# Altium schematic sheet arm_sheet.SchDoc
size A4
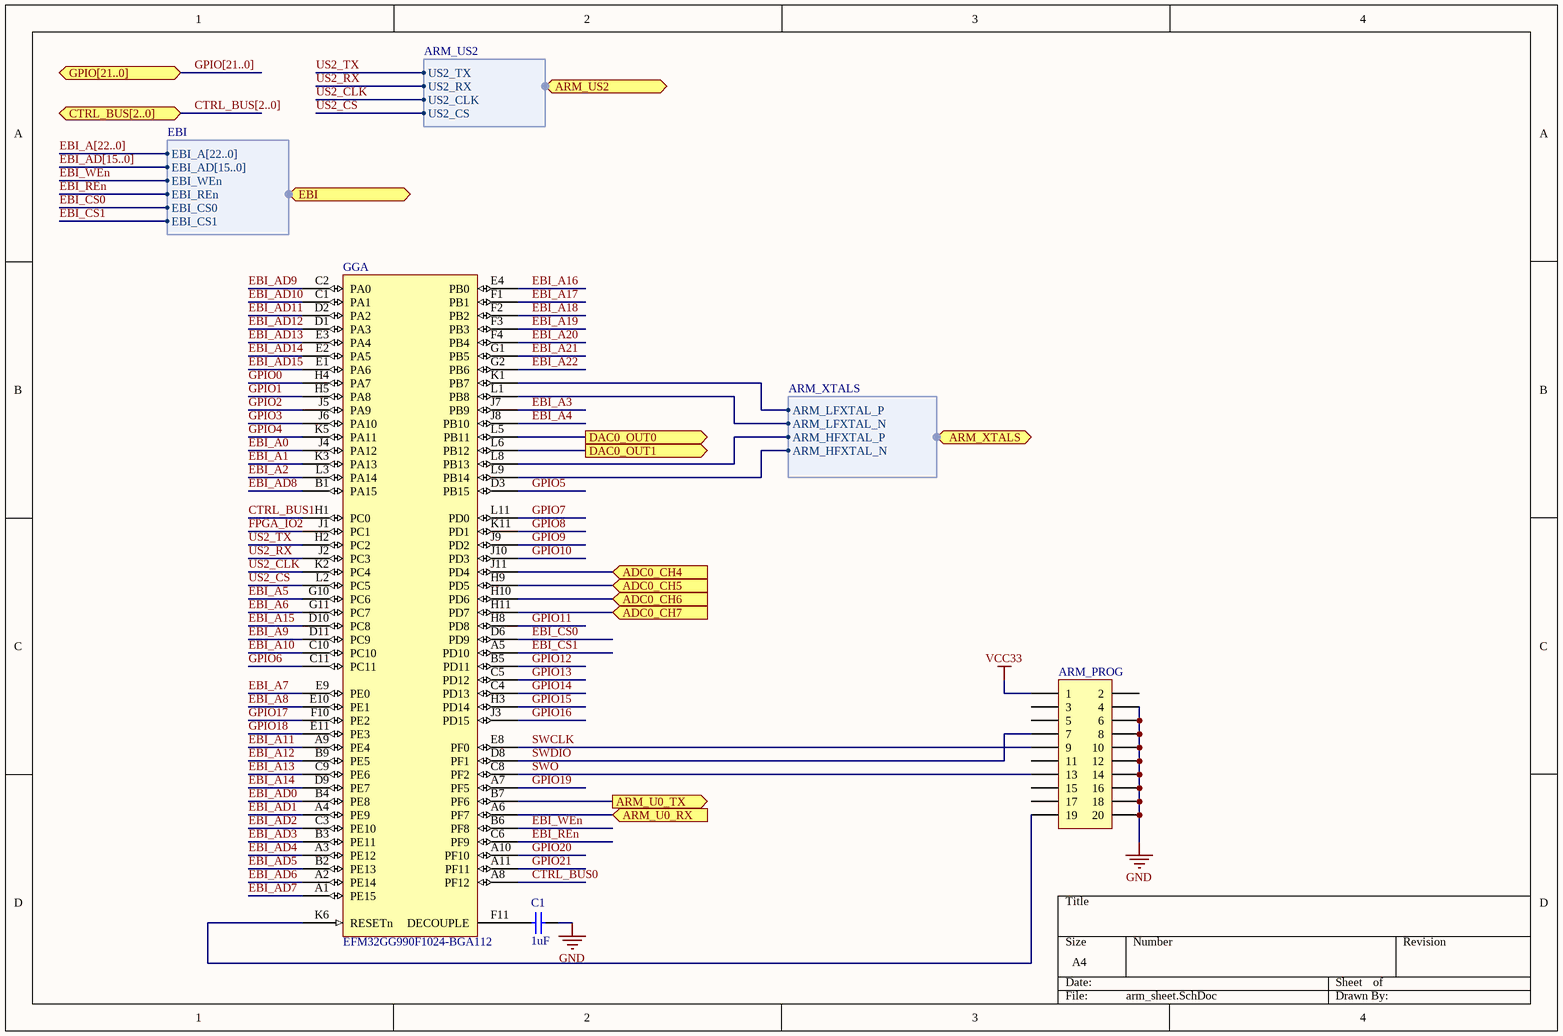
[diagram p0: arm_sheet.SchDoc]

## Parts
ARM_PROG  Header 10X2  [HDR2X10]  (value not drawn)
C1  1uF  [CAPC0805(2012)100_N]
GG  EFM32GG990F1024-BGA112  [ENMR-BGA112]  (part A of 2)

## Ports
ADC0_CH4 (in), ADC0_CH5 (in), ADC0_CH6 (in), ADC0_CH7 (in), ARM_U0_RX (in), ARM_U0_TX (out), ARM_US2 (harness ARM_US2), ARM_XTALS (harness ARM_XTALS), CTRL_BUS[2..0] (bidir), DAC0_OUT0 (out), DAC0_OUT1 (out), EBI (harness EBI), GPIO[21..0] (bidir)

## Harnesses
ARM_XTALS: ARM_LFXTAL_P, ARM_LFXTAL_N, ARM_HFXTAL_P, ARM_HFXTAL_N
EBI: EBI_A[22..0], EBI_AD[15..0], EBI_WEn, EBI_REn, EBI_CS0, EBI_CS1
ARM_US2: US2_TX, US2_RX, US2_CLK, US2_CS

## Nets
GND: ARM_PROG.4 ARM_PROG.6 ARM_PROG.8 ARM_PROG.10 ARM_PROG.12 ARM_PROG.14 ARM_PROG.16 ARM_PROG.18 ARM_PROG.20 C1.2
VCC33: ARM_PROG.1
ADC0_CH4: GG.J11(PD4) ; port ADC0_CH4
ADC0_CH5: GG.H9(PD5) ; port ADC0_CH5
ADC0_CH6: GG.H10(PD6) ; port ADC0_CH6
ADC0_CH7: GG.H11(PD7) ; port ADC0_CH7
ARM_U0_RX: GG.A6(PF7) ; port ARM_U0_RX
ARM_U0_TX: GG.B7(PF6) ; port ARM_U0_TX
CTRL_BUS0: GG.A8(PF12)
CTRL_BUS1: GG.H1(PC0)
DAC0_OUT0: GG.L5(PB11) ; port DAC0_OUT0
DAC0_OUT1: GG.L6(PB12) ; port DAC0_OUT1
EBI_A0: GG.J4(PA12)
EBI_A1: GG.K3(PA13)
EBI_A2: GG.L3(PA14)
EBI_A3: GG.J7(PB9)
EBI_A4: GG.J8(PB10)
EBI_A5: GG.G10(PC6)
EBI_A6: GG.G11(PC7)
EBI_A7: GG.E9(PE0)
EBI_A8: GG.E10(PE1)
EBI_A9: GG.D11(PC9)
EBI_A10: GG.C10(PC10)
EBI_A11: GG.A9(PE4)
EBI_A12: GG.B9(PE5)
EBI_A13: GG.C9(PE6)
EBI_A14: GG.D9(PE7)
EBI_A15: GG.D10(PC8)
EBI_A16: GG.E4(PB0)
EBI_A17: GG.F1(PB1)
EBI_A18: GG.F2(PB2)
EBI_A19: GG.F3(PB3)
EBI_A20: GG.F4(PB4)
EBI_A21: GG.G1(PB5)
EBI_A22: GG.G2(PB6)
EBI_AD0: GG.B4(PE8)
EBI_AD1: GG.A4(PE9)
EBI_AD2: GG.C3(PE10)
EBI_AD3: GG.B3(PE11)
EBI_AD4: GG.A3(PE12)
EBI_AD5: GG.B2(PE13)
EBI_AD6: GG.A2(PE14)
EBI_AD7: GG.A1(PE15)
EBI_AD8: GG.B1(PA15)
EBI_AD9: GG.C2(PA0)
EBI_AD10: GG.C1(PA1)
EBI_AD11: GG.D2(PA2)
EBI_AD12: GG.D1(PA3)
EBI_AD13: GG.E3(PA4)
EBI_AD14: GG.E2(PA5)
EBI_AD15: GG.E1(PA6)
EBI_CS0: GG.D6(PD9) ; port EBI.EBI_CS0
EBI_CS1: GG.A5(PD10) ; port EBI.EBI_CS1
EBI_REn: GG.C6(PF9) ; port EBI.EBI_REn
EBI_WEn: GG.B6(PF8) ; port EBI.EBI_WEn
FPGA_IO2: GG.J1(PC1)
GPIO0: GG.H4(PA7)
GPIO1: GG.H5(PA8)
GPIO2: GG.J5(PA9)
GPIO3: GG.J6(PA10)
GPIO4: GG.K5(PA11)
GPIO5: GG.D3(PB15)
GPIO6: GG.C11(PC11)
GPIO7: GG.L11(PD0)
GPIO8: GG.K11(PD1)
GPIO9: GG.J9(PD2)
GPIO10: GG.J10(PD3)
GPIO11: GG.H8(PD8)
GPIO12: GG.B5(PD11)
GPIO13: GG.C5(PD12)
GPIO14: GG.C4(PD13)
GPIO15: GG.H3(PD14)
GPIO16: GG.J3(PD15)
GPIO17: GG.F10(PE2)
GPIO18: GG.E11(PE3)
GPIO19: GG.A7(PF5)
GPIO20: GG.A10(PF10)
GPIO21: GG.A11(PF11)
SWCLK: ARM_PROG.9 GG.E8(PF0)
SWDIO: ARM_PROG.7 GG.D8(PF1)
SWO: ARM_PROG.13 GG.C8(PF2)
US2_CLK: GG.K2(PC4) ; port ARM_US2.US2_CLK
US2_CS: GG.L2(PC5) ; port ARM_US2.US2_CS
US2_RX: GG.J2(PC3) ; port ARM_US2.US2_RX
US2_TX: GG.H2(PC2) ; port ARM_US2.US2_TX
NetARM_PROG_19: ARM_PROG.19 GG.K6(RESETn)
NetC1_1: C1.1 GG.F11(DECOUPLE)
NetGG_K1: GG.K1(PB7) ; port ARM_XTALS.ARM_LFXTAL_P
NetGG_L1: GG.L1(PB8) ; port ARM_XTALS.ARM_LFXTAL_N
NetGG_L8: GG.L8(PB13) ; port ARM_XTALS.ARM_HFXTAL_P
NetGG_L9: GG.L9(PB14) ; port ARM_XTALS.ARM_HFXTAL_N

Not connected (* = marked no-connect by the designer): ARM_PROG 2 3 5 11 15 17

## Buses and harness runs
bus CTRL_BUS[2..0] = port CTRL_BUS[2..0]
bus EBI_A[22..0]
bus EBI_AD[15..0]
bus GPIO[21..0] = port GPIO[21..0]

## Library data of the parts
ARM_PROG = Header 10X2: Header, 10-Pin, Dual row; LatestRevisionDate: 17-Jul-2002; LatestRevisionNote: Re-released for DXP Platform.; Publisher: Altium Limited
C1 = CMP-1036-04747-1: CAP 1uF 16V ±10% 0805 (2012 Metric) Thickness 1mm SMD; Case-Metric: 2012; Case-EIA: 0805; Tolerance: ±10%; Technology: SMT; Value: 1uF; Rated Voltage: 16 V; Max Thickness: 1 mm
GG = EFM32GG990F1024-BGA112: EFM32 Giant Gecko, M3 ARM Cortex CPU, 1024 KB Flash, 128 KB RAM, 1.85 - 3.8 V Supply, 48 MHz Max Speed, -40 to 85 degC, 112-Pin BGA, RoHS Compliant; Flash (KB): 1024; GPIO: 87; LCD: 8x34; LESENSE: Y; Max Speed (MHz): 48; OPAMPS: 3; RAM (KB): 128; DatasheetVersion: Rev 1.00; PackageVersion: Rev. 97SPP01315A_X03_06Jun11; PackageReference: BGA112; PackageDescription: 112-Pin Ball Grid Array, Body 10 x 10 mm, Pitch 0.8 mm; Supplier 1: Digi-Key; Supplier Part Number 1: 914-1051-2-ND; Supplier 2: Digi-Key; Supplier Part Number 2: 914-1051-1-ND; Supplier 3: Digi-Key; Supplier Part Number 3: 914-1051-6-ND; Supplier 4: Mouser; Supplier Part Number 4: 904-EFM32GG990F1024; ARM Cortex CPU: M3; Subcategory: EFM32 Giant Gecko; Supply Voltage (V): 1.85 - 3.8; USB: Y; Mounting Technology: Surface Mount; Generic Part Number: EFM32GG990; PartNumber: EFM32GG990F1024-BGA112; ComponentLink1Description: Manufacturer URL; ComponentLink1URL: http://www.energymicro.com/; ComponentLink2Description: Datasheet; ComponentLink2URL: http://cdn.energymicro.com/dl/devices/pdf/d0046_efm32gg990_datasheet.pdf; ComponentLink3Description: Package Specification; ComponentLink3URL: http://cdn.energymicro.com/dl/devices/pdf/d0007_efm32g290_datasheet.pdf